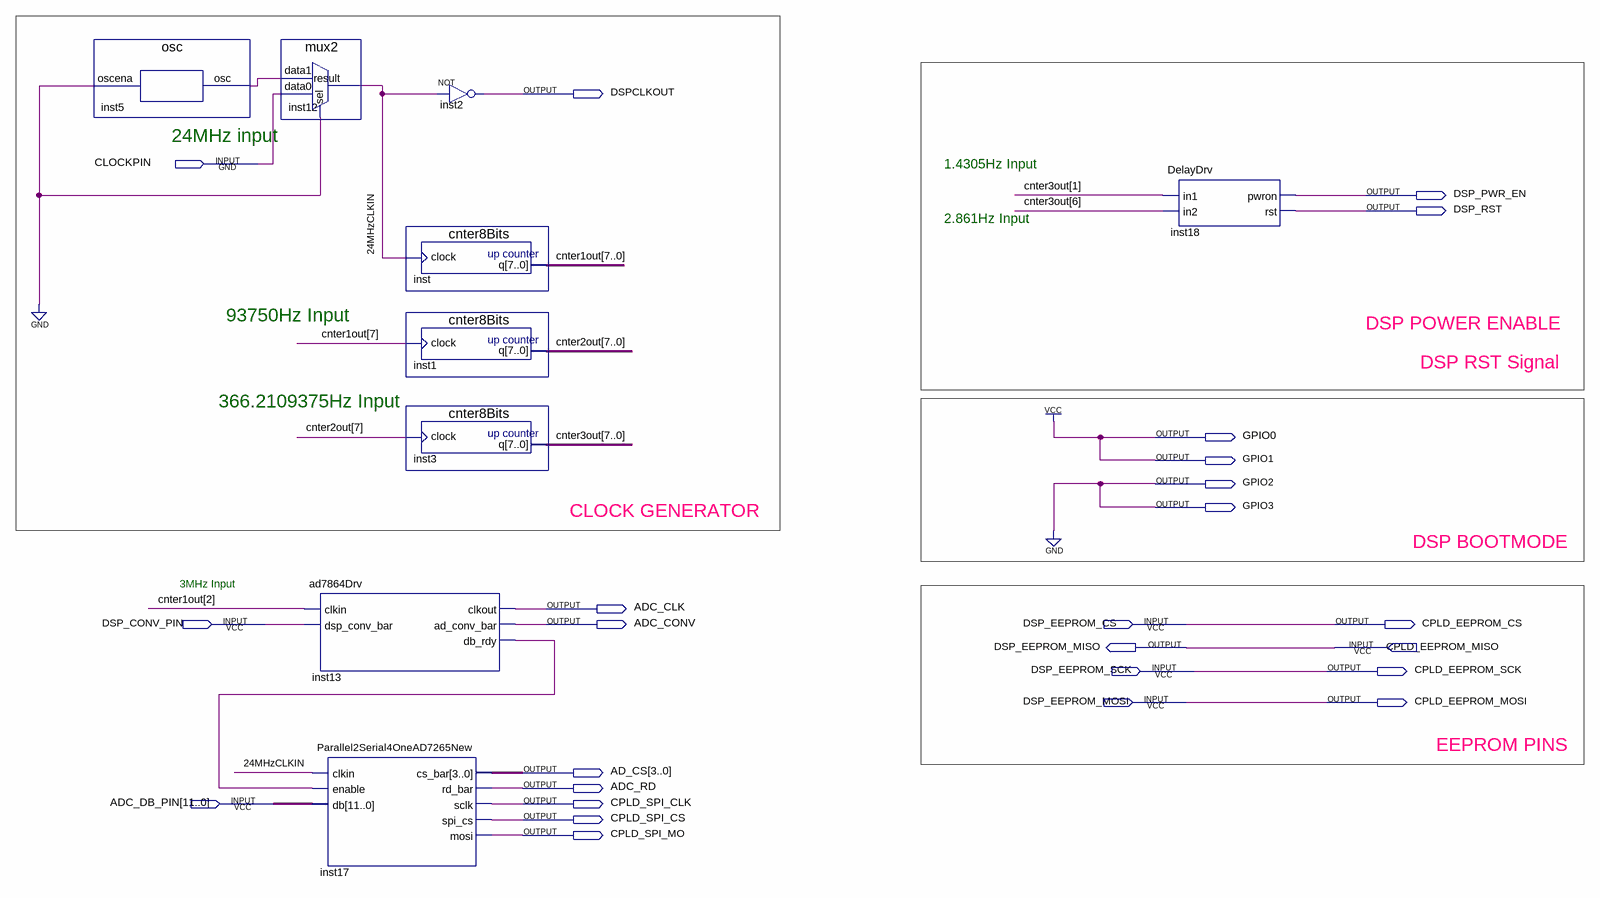
[diagram p0: schematic sheet]
// Quartus schematic basicfunctions.bdf as structural Verilog: 9 symbols, 25 pins
module basicfunctions (
  input  CLOCKPIN,
  input  DSP_CONV_PIN,
  input  DSP_EEPROM_CS,
  input  CPLD_EEPROM_MISO,
  input  DSP_EEPROM_SCK,
  input  DSP_EEPROM_MOSI,
  input  [11:0] ADC_DB_PIN,
  output DSPCLKOUT,
  output DSP_PWR_EN,
  output DSP_RST,
  output GPIO0,
  output GPIO1,
  output GPIO2,
  output GPIO3,
  output ADC_CLK,
  output ADC_CONV,
  output CPLD_EEPROM_CS,
  output DSP_EEPROM_MISO,
  output CPLD_EEPROM_SCK,
  output CPLD_EEPROM_MOSI,
  output [3:0] AD_CS,
  output ADC_RD,
  output CPLD_SPI_CLK,
  output CPLD_SPI_CS,
  output CPLD_SPI_MO
);

  wire \24MHzCLKIN , inst5_osc, inst13_db_rdy;
  wire [7:0] cnter1out, cnter2out, cnter3out;

  osc inst5 (.oscena(1'b0), .osc(inst5_osc));
  mux2 inst12 (.data1(inst5_osc), .data0(CLOCKPIN), .sel(1'b0), .result(\24MHzCLKIN ));
  ad7864Drv inst13 (
    .clkin(cnter1out[2]), .dsp_conv_bar(DSP_CONV_PIN), .clkout(ADC_CLK), .ad_conv_bar(ADC_CONV),
    .db_rdy(inst13_db_rdy));
  Parallel2Serial4OneAD7265New inst17 (
    .clkin(\24MHzCLKIN ), .enable(inst13_db_rdy), .db(ADC_DB_PIN), .cs_bar(AD_CS), .rd_bar(ADC_RD),
    .sclk(CPLD_SPI_CLK), .spi_cs(CPLD_SPI_CS), .mosi(CPLD_SPI_MO));
  cnter8Bits inst (.clock(\24MHzCLKIN ), .q(cnter1out));
  cnter8Bits inst1 (.clock(cnter1out[7]), .q(cnter2out));
  cnter8Bits inst3 (.clock(cnter2out[7]), .q(cnter3out));
  not inst2 (DSPCLKOUT, \24MHzCLKIN );
  DelayDrv inst18 (.in1(cnter3out[1]), .in2(cnter3out[6]), .pwron(DSP_PWR_EN), .rst(DSP_RST));

  assign CPLD_EEPROM_CS = DSP_EEPROM_CS;
  assign CPLD_EEPROM_MOSI = DSP_EEPROM_MOSI;
  assign CPLD_EEPROM_SCK = DSP_EEPROM_SCK;
  assign DSP_EEPROM_MISO = CPLD_EEPROM_MISO;
  assign GPIO0 = 1'b1;
  assign GPIO1 = 1'b1;
  assign GPIO2 = 1'b0;
  assign GPIO3 = 1'b0;

  // Notes on the sheet:
  //   24MHz input
  //   1.4305Hz Input
  //   2.861Hz Input
  //   93750Hz Input
  //   DSP POWER ENABLE
  //   DSP RST Signal
  //   366.2109375Hz Input
  //   CLOCK GENERATOR
  //   DSP BOOTMODE
  //   3MHz Input
  //   EEPROM PINS
endmodule
